# Altium project QFN-16 3x3, DFN-8 2x2, DFN-16 4x2.PrjPcb
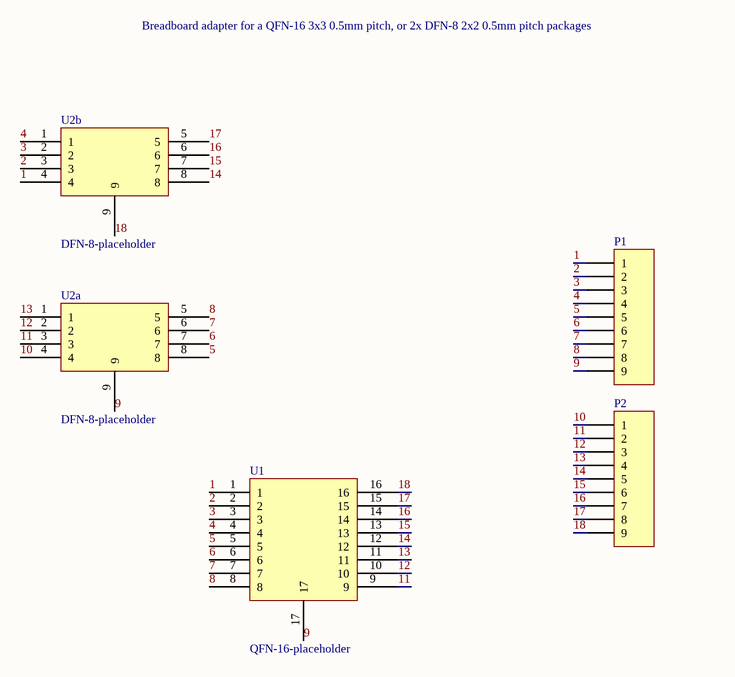
[diagram p0: Schematic.SchDoc]
1 sheet, 5 parts. Net scope: global (net labels, ports and power ports of the same name join across sheets).
Board file: PCB.PcbDoc

## Sheet Schematic.SchDoc
size A4

### Parts
P1  (no value)  [HDR1X9]
P2  (no value)  [HDR1X9]
U1  QFN-16-placeholder  [QFN50P300X300X100-17N]
U2a  DFN-8-placeholder  [SON50P200X200X60-9N]
U2b  DFN-8-placeholder  [SON50P200X200X60-9N]

### Nets
1: P1.1 U1.1 U2b.4
2: P1.2 U1.2 U2b.3
3: P1.3 U1.3 U2b.2
4: P1.4 U1.4 U2b.1
5: P1.5 U1.5 U2a.8
6: P1.6 U1.6 U2a.7
7: P1.7 U1.7 U2a.6
8: P1.8 U1.8 U2a.5
9: P1.9 U1.17 U2a.9
10: P2.1 U2a.4
11: P2.2 U1.9 U2a.3
12: P2.3 U1.10 U2a.2
13: P2.4 U1.11 U2a.1
14: P2.5 U1.12 U2b.8
15: P2.6 U1.13 U2b.7
16: P2.7 U1.14 U2b.6
17: P2.8 U1.15 U2b.5
18: P2.9 U1.16 U2b.9

### Notes on the sheet
- Breadboard adapter for a QFN-16 3x3 0.5mm pitch, or 2x DFN-8 2x2 0.5mm pitch packages

### Library data of the parts
P1 P2 = Header 9: Header, 9-Pin; LatestRevisionDate: 17-Jul-2002; LatestRevisionNote: Re-released for DXP Platform.; Publisher: Altium Limited